# EAGLE design BlinkerAA (EAGLE 9.5.2)
CNAME: Forever Blinker; CREVISION: 1
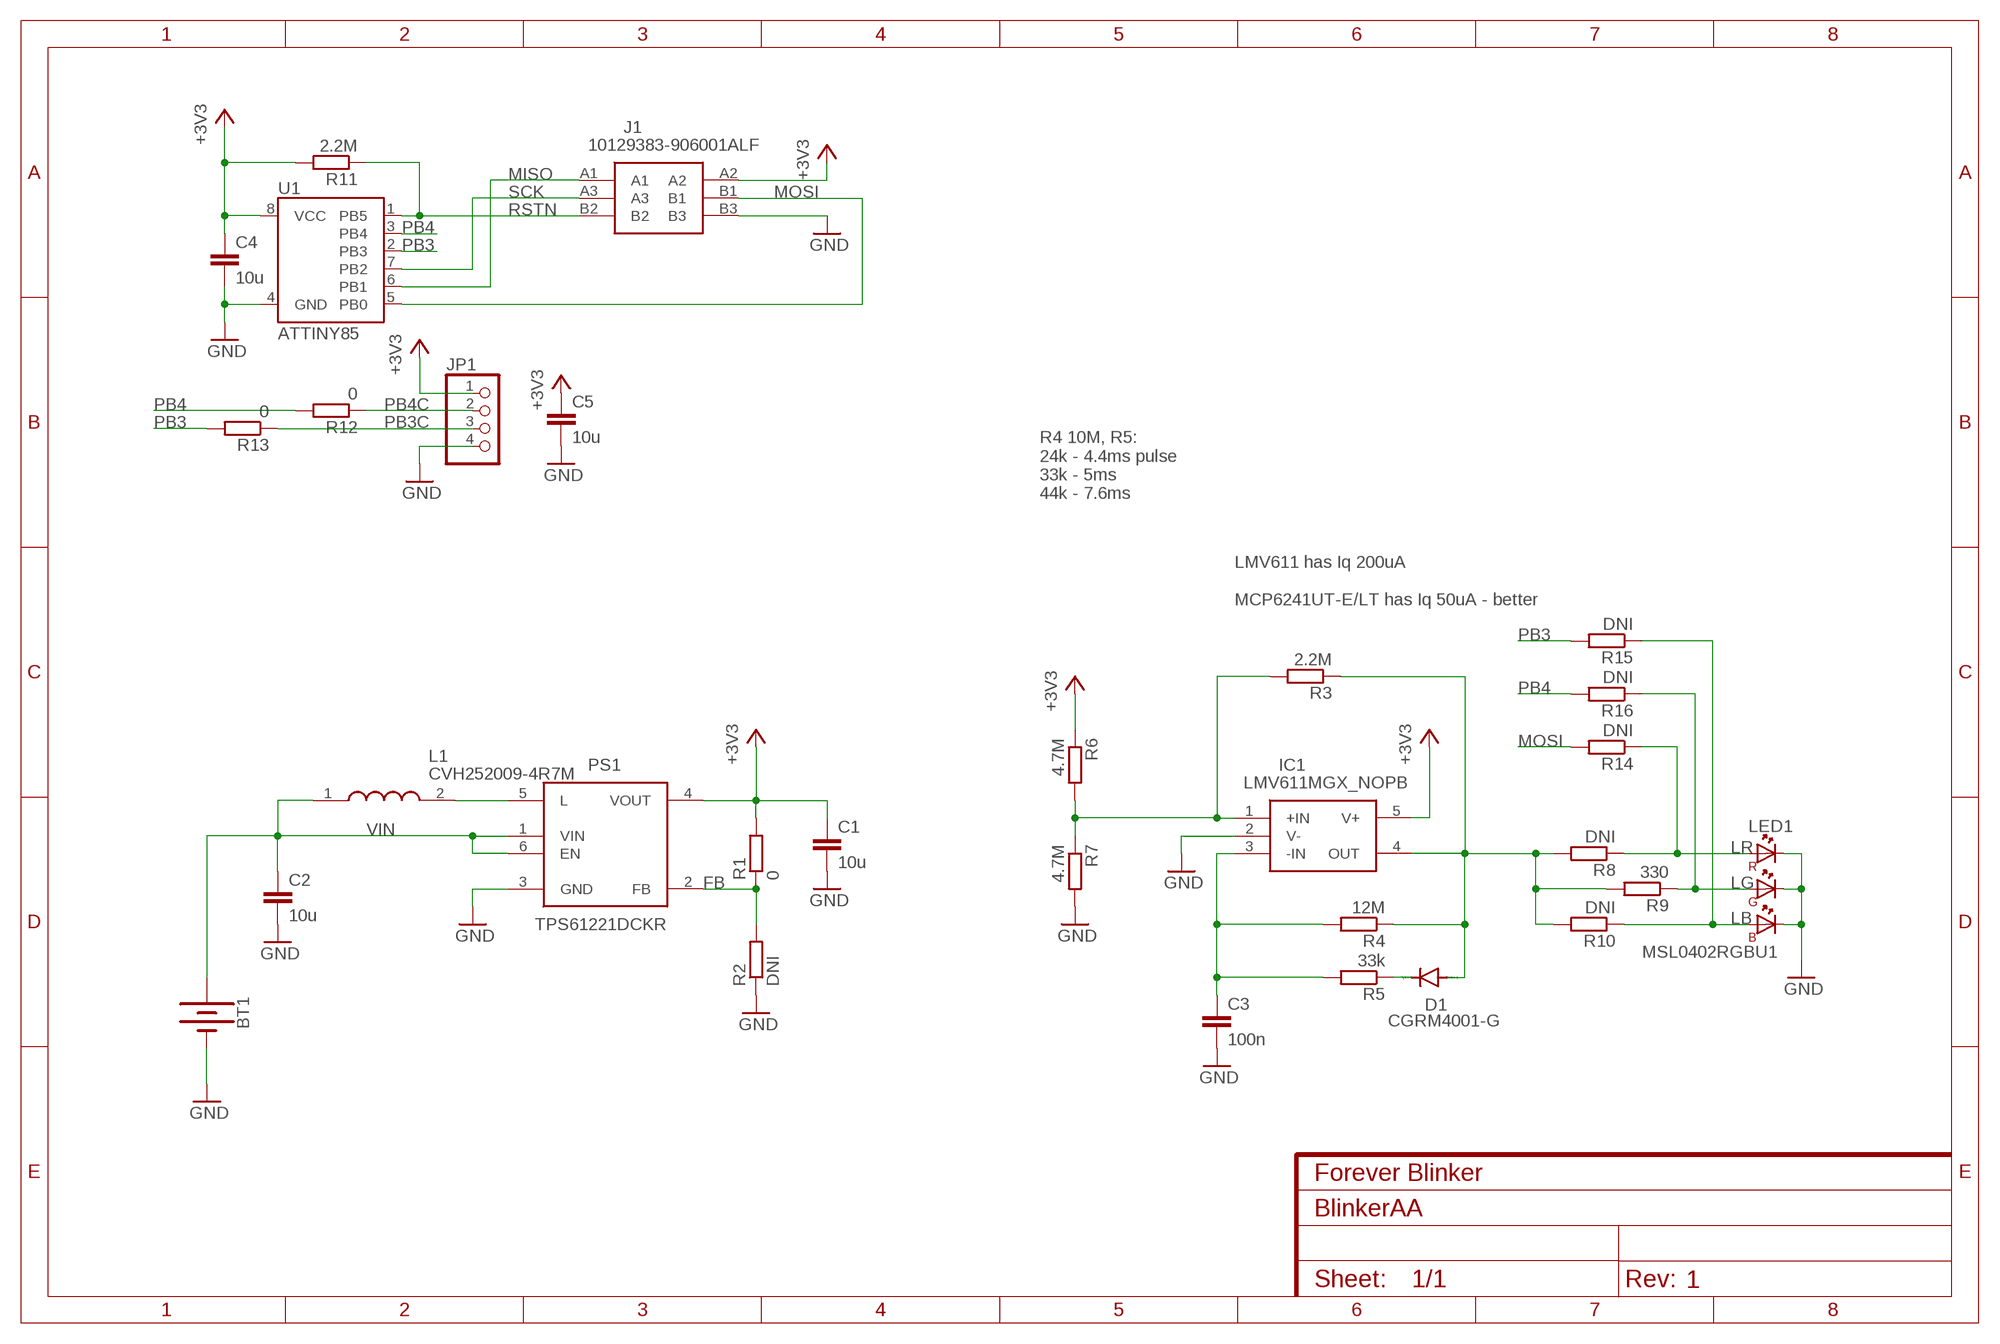
[diagram p0: schematic, sheet 1]

## Parts
BT1  BATTERY-AA  [BATTERY-AA]
C1  10u  C-EUC0603K  [C0603K]
C2  10u  C-EUC0603K  [C0603K]
C3  100n  C-EUC0603K  [C0603K]
C4  10u  C-EUC0603K  [C0603K]
C5  10u  C-EUC0603K  [C0603K]
D1  CGRM4001-G  [SOD-123_MINI-SMA]
IC1  LMV611MGX_NOPB  [SOT65P210X110-5N]
J1  10129383-906001ALF  [10129383906001ALF]
JP1  PINHD-1X4  [1X04]
L1  CVH252009-4R7M  [INDC2520X100N]
LED1  MSL0402RGBU1  [MSL0402RGBU1]
PS1  TPS61221DCKR  [SOT65P210X110-6N]
R1  0  R-EU_R0603  [R0603]
R2  DNI  R-EU_R0603  [R0603]
R3  2.2M  R-EU_R0603  [R0603]
R4  12M  R-EU_R0603  [R0603]
R5  33k  R-EU_R0603  [R0603]
R6  4.7M  R-EU_R0603  [R0603]
R7  4.7M  R-EU_R0603  [R0603]
R8  DNI  R-EU_R0603  [R0603]
R9  330  R-EU_R0603  [R0603]
R10  DNI  R-EU_R0603  [R0603]
R11  2.2M  R-EU_R0603  [R0603]
R12  0  R-EU_R0603  [R0603]
R13  0  R-EU_R0603  [R0603]
R14  DNI  R-EU_R0603  [R0603]
R15  DNI  R-EU_R0603  [R0603]
R16  DNI  R-EU_R0603  [R0603]
U1  ATTINY85  [ATTINY85]

## Nets
+3V3: C1.1 C4.1 C5.1 IC1.5(V+) J1.A2 JP1.1 PS1.4(VOUT) R1.2 R6.1 R11.2 U1.8(VCC)
FB: PS1.2(FB) R1.1 R2.2
GND: BT1.GND@1(-) C1.2 C2.2 C3.2 C4.2 C5.2 IC1.2(V-) J1.B3 JP1.4 LED1.1(K_B) LED1.2(K_G) LED1.3(K_R) PS1.3(GND) R2.1 R7.2 U1.4(GND)
LB: LED1.6(A_B) R10.1 R15.1
LG: LED1.5(A_G) R9.1 R16.1
LR: LED1.4(A_R) R8.1 R14.1
MISO: J1.A1 U1.6(PB1)
MOSI: J1.B1 R14.2 U1.5(PB0)
N$2: IC1.1(+IN) R3.2 R6.2 R7.1
N$3: L1.2 PS1.5(L)
N$4: D1.A IC1.4(OUT) R3.1 R4.1 R8.2 R9.2 R10.2
N$7: C3.1 IC1.3(-IN) R4.2 R5.2
N$10: D1.C R5.1
PB3: R13.2 R15.2 U1.2(PB3)
PB3C: JP1.3 R13.1
PB4: R12.2 R16.2 U1.3(PB4)
PB4C: JP1.2 R12.1
RSTN: J1.B2 R11.1 U1.1(PB5)
SCK: J1.A3 U1.7(PB2)
VIN: BT1.PWR@1(+) C2.1 L1.1 PS1.1(VIN) PS1.6(EN)

## Notes on the sheet
- R4 10M, R5:
  24k - 4.4ms pulse
  33k - 5ms
  44k - 7.6ms
- LMV611 has Iq 200uA 
  
  MCP6241UT-E/LT has Iq 50uA - better

## Library data of the parts
BT1 = SparkFun-Batteries:BATTERY: Battery - Single Cell A variety of battery chemistries, sizes, and footprints. Device List: 20MM_PTH - Coin Cell Battery Holder - 20mm (PTH) <https://www.sparkfun.com/products/783> 20MM_PTH_KIT- Coin Cell battery Holder - 20 mm (PTH) <http://www.sparkfun.com/products/783>kit version with special mask 6.8MM_PTH - Coin Cell Battery Holder - 6.8MM(SMD) <https://www.digikey.com/product-detail/en/seiko-instruments/MS621FE-FL11E/728-1057-ND/1889208?WT.srch=1&gclid=CNOQ5a6LzdQCFZS2wAodXCkE0g> 12MM_SMD - Coin Cell Battery Holder - 12mm (SMD) <https://www.sparkfun.com/products/10592> 12MM_PTH - Coin Cell Battery Holder - 12mm (PTH) <https://www.sparkfun.com/products/7948> 20MM_SMD - 20mm Coin Cell Battery Holder (SMD) (2 legs) Used on the Big Time Watch Kit <https://www.sparkfun.com/products/11734> 20MM_SMD_4LEGS - Coin Cell Battery Holder - 20mm (SMD) <https://www.sparkfun.com/products/11892> 20MM_SMD_4LEGS_OVERPASTE - Coin Cell Battery Holder - 20mm (SMD) <https://www.sparkfun.com/products/11892> (Over-paste on the legs) 24.5MM_PTH - Coin Cell Battery Holder - 24.5mm (PTH) <https://www.sparkfun.com/products/8863> 9V - 9V Battery Holder - PC Mount Used on the SparkFun SparkPunk Sound Kit <https://www.sparkfun.com/products/11177> and SparkFun SparkPunk Sequencer Kit <https://www.sparkfun.com/products/12707> 18650 - Battery Holder - 18650 (PTH) <https://www.sparkfun.com/products/13113> AA - Battery Holder - 1xAA (PTH) <https://www.sparkfun.com/products/7949> AAA - Battery Holder - 1xAAA (PTH) <https://www.sparkfun.com/products/12718> AA_KIT - Battery Holder - 1xAA (PTH) <https://www.sparkfun.com/products/7949> Special kit package - pads only have exposed copper on one side of the board. AAA_KIT - Battery Holder - 1xAAA (PTH) <https://www.sparkfun.com/products/12718> Special kit package - pads only have exposed copper on one side of the board.; PROD_ID: BATT-08316; SF_SKU: PRT-07949
C1-C5 = resistor:C-EU: CAPACITOR, European symbol; PARTNO: GRM188R61A106KE69J
D1 = diode:CGRM400*-G: Molded plasitc,JEDEC SOD-123/Mini SMA Source: Comchip CGRM4001-G.pdf
IC1 = SamacSys_Parts:LMV611MGX_NOPB: Single low voltage, low power, RRIO general purpose amplifier Source: Datasheet <http://www.ti.com/lit/gpn/LMV611>; DESCRIPTION: Single low voltage, low power, RRIO general purpose amplifier; HEIGHT: 1.1mm; MANUFACTURER_NAME: Texas Instruments; MANUFACTURER_PART_NUMBER: LMV611MGX/NOPB
J1 = SamacSys_Parts:10129383-906001ALF: Headers & Wire Housings ECONOSTIK HEADER DR VT SMT 2X3 Source: Datasheet <https://componentsearchengine.com/Datasheets/1/10129383-906001ALF.pdf>; DESCRIPTION: Headers & Wire Housings ECONOSTIK HEADER DR VT SMT 2X3; HEIGHT: 8.58mm; MANUFACTURER_NAME: Amphenol; MANUFACTURER_PART_NUMBER: 10129383-906001ALF; MOUSER_PART_NUMBER: 649-1012938390601ALF; MOUSER_PRICE-STOCK: https://www.mouser.com/Search/Refine.aspx?Keyword=649-1012938390601ALF
JP1 = pinhead:PINHD-1X4: PIN HEADER
L1 = SamacSys_Parts:CVH252009-4R7M: BOURNS - CVH252009-4R7M - INDUCTOR, POWER, 20%, 4.7UH Source: Datasheet <https://componentsearchengine.com/Datasheets/1/CVH252009-4R7M.pdf>; DESCRIPTION: BOURNS - CVH252009-4R7M - INDUCTOR, POWER, 20%, 4.7UH; HEIGHT: 1mm; MANUFACTURER_NAME: Bourns; MANUFACTURER_PART_NUMBER: CVH252009-4R7M; MOUSER_PART_NUMBER: 652-CVH252009-4R7M; MOUSER_PRICE-STOCK: https://www.mouser.com/Search/Refine.aspx?Keyword=652-CVH252009-4R7M
LED1 = SamacSys_Parts:MSL0402RGBU1: High Brightness RGB LED SMT 1816(0706) Source: Datasheet <https://componentsearchengine.com/Datasheets/1/MSL0402RGBU1.pdf>; DESCRIPTION: High Brightness RGB LED SMT 1816(0706); HEIGHT: 0mm; MANUFACTURER_NAME: ROHM Semiconductor; MANUFACTURER_PART_NUMBER: MSL0402RGBU1; MOUSER_PART_NUMBER: 755-MSL0402RGBU1; MOUSER_PRICE-STOCK: https://www.mouser.com/Search/Refine.aspx?Keyword=755-MSL0402RGBU1
PS1 = SamacSys_Parts:TPS61221DCKR: TEXAS INSTRUMENTS - TPS61221DCKR . - Boost (Step Up) Switching Regulator, Fixed, 700 mV to 5.5 V In, 3.3 V/400 mA Out, 2 MHz, SC-70-6 Source: Datasheet <http://www.ti.com/lit/ds/symlink/tps61221.pdf>; DESCRIPTION: TEXAS INSTRUMENTS - TPS61221DCKR . - Boost (Step Up) Switching Regulator, Fixed, 700 mV to 5.5 V In, 3.3 V/400 mA Out, 2 MHz, SC-70-6; HEIGHT: 1.1mm; MANUFACTURER_NAME: Texas Instruments; MANUFACTURER_PART_NUMBER: TPS61221DCKR
R1-R16 = rcl:R-EU_: RESISTOR, European symbol; SPICEPREFIX: R
U1 = SparkFun-IC-Microcontroller:ATTINY85; PROD_ID: IC-09092

## Board
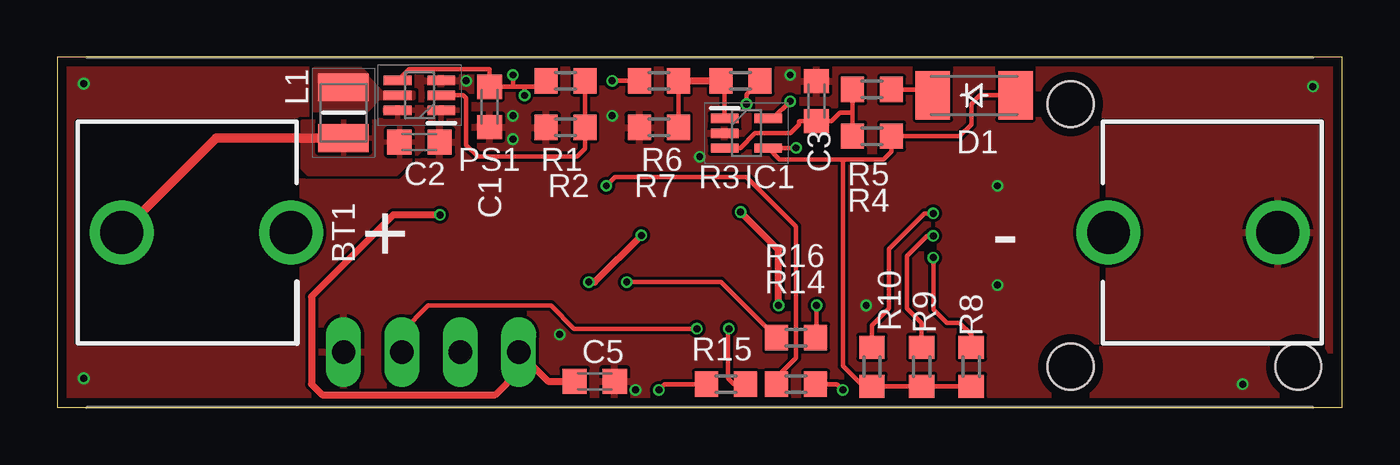
[diagram p1: board, top side]
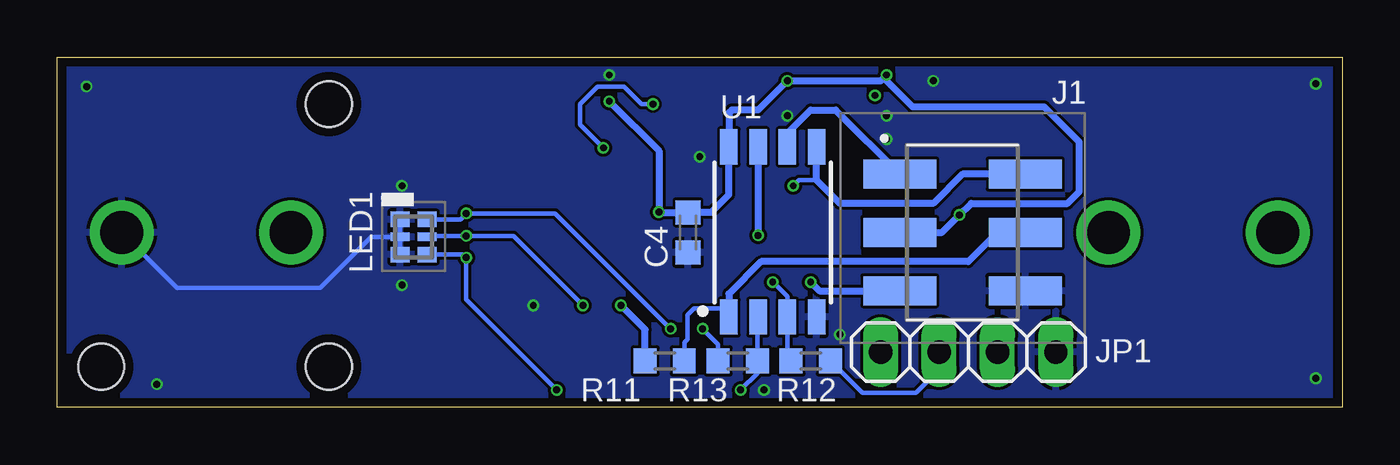
[diagram p2: board, bottom side, seen from below]

Size 55.88 x 15.24 mm. Coordinates in mm from the lower left corner, seen from the top.
Outline: 0,0 55.88,0 55.88,15.24 0,15.24 0,0
Copper layers (1*16): Top 0.035mm / dielectric 1.6mm / Bottom 0.035mm
Design rules "AllPCB": minimum track width 5mil, minimum drill 0.3mm, track to track 5mil, track to pad 6mil, pad to pad 6mil, via to via 7mil, smd to smd 5mil, copper to edge 0.4mm, drill to drill 24mil, minimum pad ring 6mil, minimum via ring 4mil, stop-mask expansion 4mil, vias tented up to drill 0.3mm, thermal gap 6mil
Holes 2 mm at 53.98,1.78 44.07,1.78 44.07,13.21

### Footprints (pad centres in the part's own frame; a part is rotated, then mirrored left to right if it is on the bottom)
BATTERY-AA = drill 1.854: GND@1 25.146,0; GND@2 17.78,0; PWR@1 -25.146,0; PWR@2 -17.78,0
C0603K = smd 1.05 x 1.08: 1 -0.875,0; 2 0.875,0
SOD-123_MINI-SMA = smd 1.5 x 2.1: A 1.8,0; C -1.8,0
SOT65P210X110-5N = smd 1.2 x 0.4: 1 -0.95,0.65; 2 -0.95,0; 3 -0.95,-0.65; 4 0.95,-0.65; 5 0.95,0.65
10129383906001ALF = smd 1.27 x 3.18: A1 -2.54,-2.73; A2 0,-2.73; A3 2.54,-2.73; B1 -2.54,2.73; B2 0,2.73; B3 2.54,2.73
1X04 = drill 1.016 long: 1 -3.81,0; 2 -1.27,0; 3 1.27,0; 4 3.81,0
INDC2520X100N = smd 1.2 x 2.2: 1 -1.1,0; 2 1.1,0
MSL0402RGBU1 = smd 0.67 x 0.83: 1 0.32,0.585; 3 -1.22,0.585; 4 -1.22,-0.585; 6 0.32,-0.585 | smd 0.37 x 0.83: 2 -0.45,0.585; 5 -0.45,-0.585
SOT65P210X110-6N = smd 1.2 x 0.4: 1 -0.95,0.65; 2 -0.95,0; 3 -0.95,-0.65; 4 0.95,-0.65; 5 0.95,0; 6 0.95,0.65
R0603 = smd 1 x 1.1: 1 -0.85,0; 2 0.85,0
ATTINY85 = smd 1.524 x 0.762: 1 -3.683,1.905; 2 -3.683,0.635; 3 -3.683,-0.635; 4 -3.683,-1.905; 5 3.727,-1.905; 6 3.727,-0.635; 7 3.727,0.635; 8 3.727,1.905

### Placement (x,y rotation side)
BT1  27.94,7.62 0 top
C1  18.8,13.08 270 top
C2  15.75,11.56 0 top
C3  33.02,13.34 90 top
C4  28.45,7.62 270 bottom
C5  23.37,1.14 0 top
D1  39.88,13.59 0 top
IC1  29.97,11.94 0 top
J1  16.51,7.62 270 bottom
JP1  16.26,2.41 0 bottom
L1  12.45,12.83 90 top
LED1  40.39,7.87 90 bottom
PS1  15.75,13.59 180 top
R1  22.1,14.22 180 top
R2  22.1,12.19 0 top
R3  29.72,14.22 180 top
R4  35.43,11.81 180 top
R5  35.43,13.84 180 top
R6  26.16,14.22 0 top
R7  26.16,12.19 180 top
R8  39.75,1.78 270 top
R9  37.59,1.78 270 top
R10  35.43,1.78 270 top
R11  29.46,2.03 180 bottom
R12  23.11,2.03 180 bottom
R13  26.29,2.03 0 bottom
R14  32.13,1.02 180 top
R15  29.08,1.02 180 top
R16  32.13,3.05 180 top
U1  24.77,7.62 90 bottom

### Tracks (layer width: path | path; a pad name or v marks a point on that pad's centre or on a via)
+3V3  (via drill 0.3)
  Top 0.203: PS1.4 15.29,14.73 18.8,14.73 C1.1 | C1.1 | R1.2 20.99,13.97 20.32,13.97 | 20.32,13.97 19.81,13.97 | 19.81,13.97 C1.1 | v19.81,14.48 19.81,13.97 | v20.32,13.59 20.32,13.97 | R6.1 v24.13,14.22 | IC1.5 31.13,12.59 v31.88,13.34
  Top 0.305: C5.1 21.34,1.14 JP1.1 20.07,1.57 19.05,0.55 11.51,0.55 11.05,1.02 11.05,4.83 14.61,8.38 v16.64,8.38 | v31.37,4.45 31.37,6.86 v29.72,8.51
  Bottom 0.305: J1.A2 17.4,7.62 v16.64,8.38 16.13,8.89 11.94,8.89 11.43,9.4 11.43,11.56 12.95,13.08 18.67,13.08 19.81,14.22 v19.81,14.48 20.07,14.22 v24.13,14.22 25.4,12.95 26.54,12.95 26.67,12.83 U1.8 26.67,9.27 27.43,8.51 28.43,8.51 C4.1 29.7,8.49 v29.72,8.51 29.72,11.18 v31.88,13.34 | R11.2 30.31,3.39 v31.37,4.45
FB
  Top 0.203: R1.1 R2.2 22.95,11.26 22.61,10.92 18.29,10.92 17.78,11.43 17.78,13.46 17.65,13.59 PS1.2
GND  (via drill 0.3)
  Bottom 0.203: LED1.1 LED1.2 | LED1.2 LED1.3 | LED1.2 42.23,7.42 44.45,5.21 50.67,5.21 BT1.GND@1
  other vias: 17.78,14.22 19.81,12.7 19.81,11.68 24.13,12.7 31.88,14.48 21.84,3.17 25.15,0.76 27.94,10.92 35.18,4.45 51.56,1.02 54.61,13.97 1.14,14.1 1.14,1.27 40.89,5.33 40.89,9.65
  pour Bottom (isolate 0.008): -2.29,17.53 -2.29,-3.56 58.8,-3.56 58.8,17.53
  pour Top (isolate 0.008, rank 2): -4.45,19.56 61.85,19.56 61.85,-5.97 -4.45,-5.97
LB  (via drill 0.3)
  Top 0.203: v38.1,8.45 37.72,8.45 36.18,6.91 36.18,4.32 35.43,3.57 R10.1 | R15.1 29.43,1.02 29.17,1.27 29.17,3.39 v29.21,3.43
  Bottom 0.203: LED1.6 38.35,8.19 v38.1,8.45 34.23,8.45 v29.21,3.43
LG  (via drill 0.3)
  Top 0.203: v38.1,7.47 37.83,7.47 36.95,6.59 36.95,4.32 37.59,3.67 R9.1 | R16.1 33.02,3.09 v33.02,4.45
  Bottom 0.203: LED1.5 39.75,7.47 v38.1,7.47 36.05,7.47 v33.02,4.45
LR  (via drill 0.3)
  Top 0.203: v38.1,6.53 38.1,4.28 38.7,3.68 39.24,3.68 39.75,3.17 R8.1 | R14.1 33.91,1.02 v34.16,0.76
  Bottom 0.203: LED1.4 38.23,6.65 v38.1,6.53 38.1,4.7 v34.16,0.76
MISO
  Bottom 0.305: U1.6 24.13,11.94 23.11,12.95 22.03,12.95 J1.A1
MOSI  (via drill 0.3)
  Top 0.203: R14.2 31.28,1.31 32.13,2.16 32.13,7.87 29.97,10.03 24.26,10.03 v23.88,9.65
  Bottom 0.203: v23.88,9.65 23.62,9.91 22.86,9.91
  Bottom 0.305: J1.B1 16.51,10.16 17.78,8.89 21.84,8.89 22.86,9.91 U1.5
N$2
  Top 0.203: R6.2 R7.1 | IC1.1 29.02,14.07 R3.2
  Top 0.305: R6.2 R3.2
N$3
  pour Top (no thermals): 15.49,13.46 15.49,13.72 14.1,13.72 13.46,14.35 13.46,14.48 13.21,14.73 11.18,14.73 11.18,12.95 13.46,12.95 13.97,13.46
N$4  (via drill 0.3)
  Top 0.203: 34.16,10.79 35.94,10.79 36.28,11.14 R4.1 39.24,11.81 39.75,12.32 39.75,13.21 40.13,13.59 D1.A | 34.16,10.79 31.41,10.79 IC1.4 32.12,11.29 v32.13,11.3 | R8.2 R9.2 R10.2 35.05,0.93 34.16,1.82 34.16,10.79 | R3.1 29.97,13.63 v29.97,13.21
  Bottom 0.203: v29.97,13.21 30.48,13.21 31.24,13.97 31.75,13.97 32.38,13.97 33.15,13.21 33.15,12.32 v32.13,11.3
N$7
  Top 0.203: R5.2 34.58,12.83 | 34.58,12.83 R4.2 | IC1.3 29.7,11.29 30.35,11.94 31.88,11.94 32.26,12.32 32.26,12.45 32.27,12.46 C3.1 33.67,12.46 34.04,12.83 34.58,12.83
N$10
  Top 0.203: R5.1 37.82,13.84 D1.C
PB3  (via drill 0.3)
  Top 0.203: v26.16,0.76 26.42,1.02 R15.2
  Bottom 0.203: v26.16,0.76 25.44,1.49 R13.2 25.44,3.9 U1.2
PB3C  (via drill 0.3)
  Top 0.203: v27.81,3.43 22.48,3.43 21.46,4.45 16.13,4.45 14.99,3.3 JP1.3
  Bottom 0.203: R13.1 27.14,2.75 v27.81,3.43
PB4  (via drill 0.3)
  Top 0.203: v24.77,5.46 28.87,5.46 R16.2
  Bottom 0.203: R12.2 24.13,2.2 U1.3 24.13,4.83 v24.77,5.46
PB4C
  Bottom 0.203: R12.1 20.87,0.64 18.54,0.64 17.53,1.65 JP1.2
RSTN
  Bottom 0.203: R11.1 28.61,2.84 28.48,2.98 28.48,4.04 28.19,4.32 27.05,4.32 U1.1
  Bottom 0.305: J1.B2 14.99,7.62 16.26,6.35 25.27,6.35 26.67,4.95 U1.1
SCK  (via drill 0.3)
  Top 0.305: v25.4,7.49 23.37,5.46 v23.11,5.46
  Bottom 0.305: U1.7 v25.4,7.49 | v23.11,5.46 22.73,5.08 J1.A3
VIN
  Top 0.406: 12.95,11.94 12.66,11.94 L1.1 6.9,11.73 BT1.PWR@1
  pour Top: 14.22,13.08 14.22,12.7 13.97,12.45 10.67,12.45 10.67,10.41 10.92,10.16 14.73,10.16 15.88,11.3 15.88,12.57 17.4,12.57 17.4,13.08

### Text on the board
bDocu: Electronics / design / solutions s.r.o. | Juraj Repčík